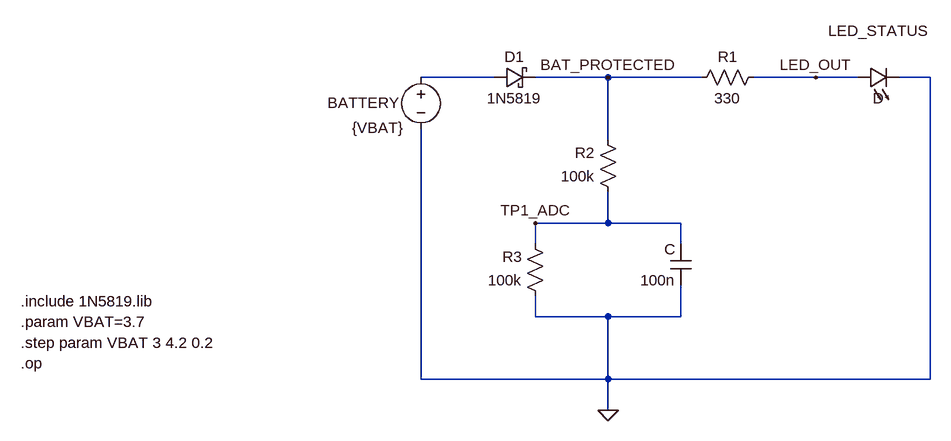
[diagram p0: schematic Battery_Protection_Simulation.asc]
Battery_Protection_Simulation.asc, the LTspice schematic file:
Version 4.1
SHEET 1 936 680
WIRE 160 96 48 96
WIRE 336 96 224 96
WIRE 480 96 336 96
WIRE 656 96 560 96
WIRE 720 96 656 96
WIRE 832 96 784 96
WIRE 336 192 336 96
WIRE 336 320 336 272
WIRE 336 320 224 320
WIRE 448 320 336 320
WIRE 224 352 224 320
WIRE 448 352 448 320
WIRE 224 464 224 432
WIRE 336 464 224 464
WIRE 448 464 448 416
WIRE 448 464 336 464
WIRE 48 560 48 176
WIRE 336 560 336 464
WIRE 336 560 48 560
WIRE 832 560 832 96
WIRE 832 560 336 560
WIRE 336 608 336 560
FLAG 336 608 0
FLAG 336 96 BAT_PROTECTED
FLAG 224 320 TP1_ADC
FLAG 656 96 LED_OUT
SYMBOL voltage 48 80 R0
WINDOW 0 -144 55 Left 2
WINDOW 3 -106 93 Left 2
WINDOW 123 0 0 Left 0
WINDOW 39 0 0 Left 0
SYMATTR InstName BATTERY
SYMATTR Value {VBAT}
SYMBOL res 576 80 R90
WINDOW 0 0 56 VBottom 2
WINDOW 3 32 56 VTop 2
SYMATTR InstName R1
SYMATTR Value 330
SYMBOL LED 720 112 R270
WINDOW 0 72 32 VTop 2
WINDOW 3 0 32 VBottom 2
SYMATTR InstName LED_STATUS
SYMBOL res 352 288 R180
WINDOW 0 36 76 Left 2
WINDOW 3 36 40 Left 2
SYMATTR InstName R2
SYMATTR Value 100k
SYMBOL res 240 448 R180
WINDOW 0 36 76 Left 2
WINDOW 3 36 40 Left 2
SYMATTR InstName R3
SYMATTR Value 100k
SYMBOL cap 464 416 R180
WINDOW 0 24 56 Left 2
WINDOW 3 24 8 Left 2
SYMATTR InstName C
SYMATTR Value 100n
SYMBOL schottky 160 112 R270
WINDOW 0 32 32 VTop 2
WINDOW 3 0 32 VBottom 2
SYMATTR InstName D1
SYMATTR Value 1N5819
SYMATTR Description Diode
SYMATTR Type diode
TEXT -568 472 Left 2 !.param VBAT=3.7
TEXT -568 504 Left 2 !.step param VBAT 3 4.2 0.2
TEXT -568 536 Left 2 !.op
TEXT -568 440 Left 2 !.include 1N5819.lib

The netlist it stands for:
* Battery_Protection_Simulation.asc
V§BATTERY N001 0 {VBAT}
R1 LED_OUT BAT_PROTECTED 330
D§LED_STATUS LED_OUT 0 D
R2 TP1_ADC BAT_PROTECTED 100k
R3 0 TP1_ADC 100k
C 0 TP1_ADC 100n
D1 N001 BAT_PROTECTED 1N5819
.model D D
.lib standard.dio
.param VBAT=3.7
.step param VBAT 3 4.2 0.2
.op
.include 1N5819.lib
.backanno
.end

* Results of the author's LTspice run, read from the files saved beside the schematic
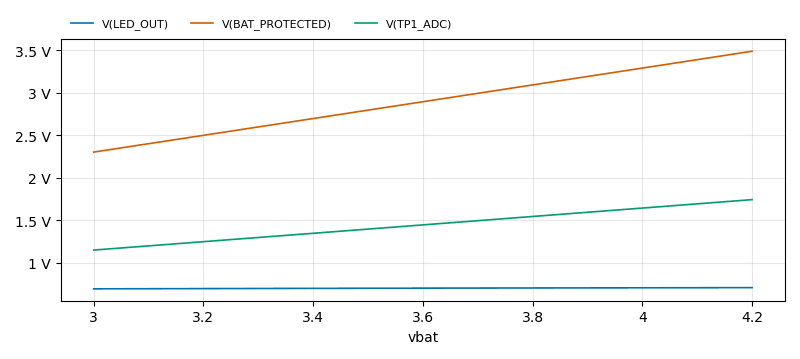
[diagram p1: Operating Point of Battery_Protection_Simulation.asc, plotted from the saved traces]
* Operating Point, 1 run:
*   V(LED_OUT): 696.1 mV at vbat=3 , 710.2 mV at vbat=4.2 , min 696.1 mV, max 710.2 mV
*   V(BAT_PROTECTED): 2.304 V at vbat=3 , 3.49 V at vbat=4.2 , min 2.304 V, max 3.49 V
*   V(TP1_ADC): 1.152 V at vbat=3 , 1.745 V at vbat=4.2 , min 1.152 V, max 1.745 V